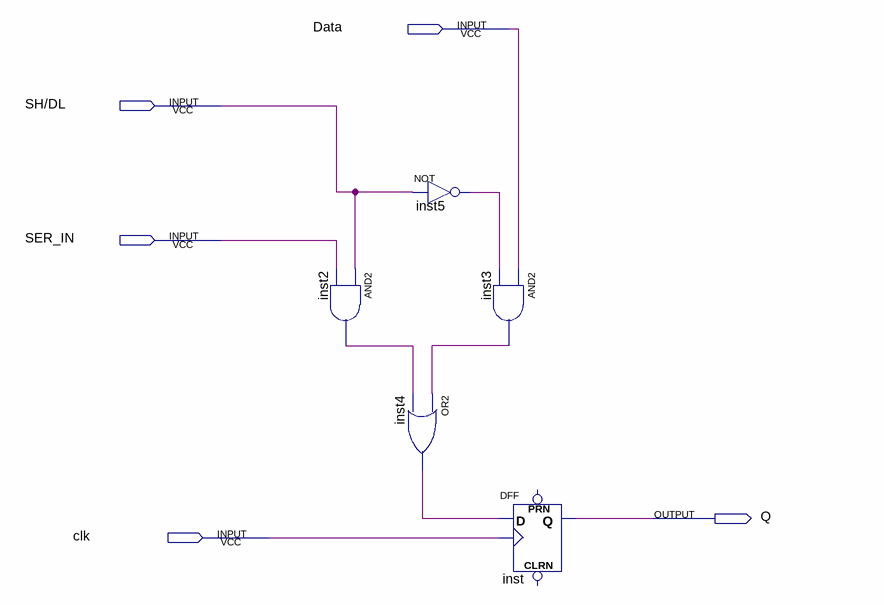
[diagram p0: schematic sheet]
// Quartus schematic Component_paralele_serie.bdf as structural Verilog: 5 symbols, 5 pins
module Component_paralele_serie (
  input  Data,
  input  \SH/DL ,
  input  SER_IN,
  input  clk,
  output Q
);

  wire inst2_out, inst3_out, inst4_out, inst5_out;

  and inst2 (inst2_out, \SH/DL , SER_IN);
  or inst4 (inst4_out, inst3_out, inst2_out);
  not inst5 (inst5_out, \SH/DL );
  and inst3 (inst3_out, Data, inst5_out);
  DFF inst (.CLK(clk), .D(inst4_out), .Q(Q));  // open: CLRN, PRN
endmodule
